# EAGLE design tinyblink-rev3.2.1 (EAGLE 7.3.0)
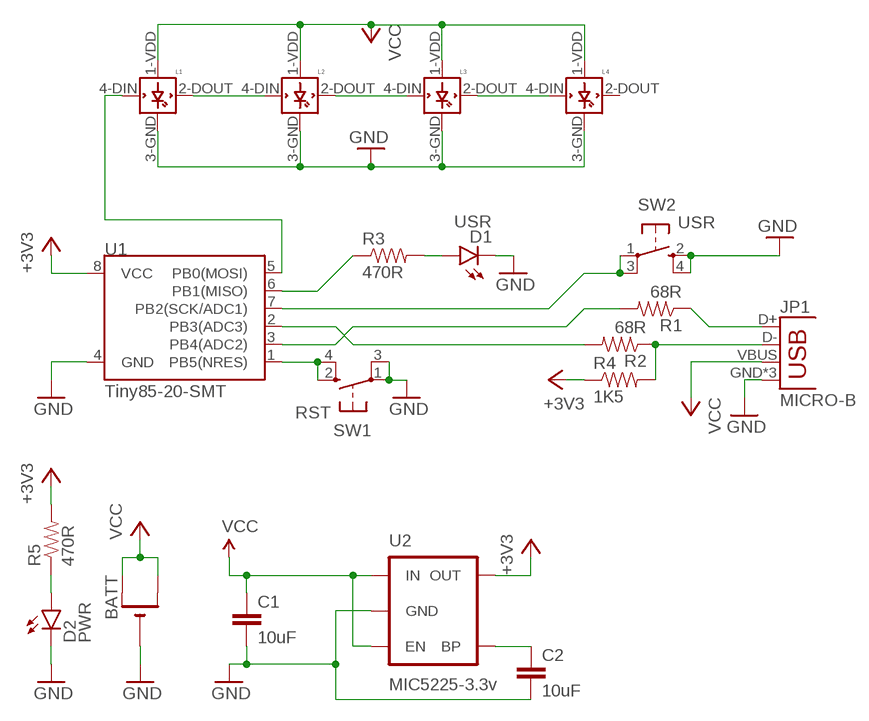
[diagram p0: schematic, sheet 1]

## Parts
BATT  CR2032SMT  [CR2032-SMD]
C1  10uF  CAP0603-CAP  [0603-CAP]
C2  10uF  CAP0603-CAP  [0603-CAP]
D1  USR  LED-RED0603  [LED-0603]
D2  PWR  LED-GREEN0603  [LED-0603]
JP1  MICRO-B  USB-MICROB  [USB-MICROB]
L1  WS2812B  [WS2812B]
L2  WS2812B  [WS2812B]
L3  WS2812B  [WS2812B]
L4  WS2812B  [WS2812B]
R1  68R  RESISTOR0603-RES  [0603-RES]
R2  68R  RESISTOR0603-RES  [0603-RES]
R3  470R  RESISTOR0603-RES  [0603-RES]
R4  1K5  RESISTOR0603-RES  [0603-RES]
R5  470R  RESISTOR0603-RES  [0603-RES]
SW1  RST  SPST_TACT-KMR2  [KMR2]
SW2  USR  SPST_TACT-KMR2  [KMR2]
U1  Tiny85-20-SMT  ATTINY45TINY85-20-SMT  [SO08-EIAJ]
U2  MIC5225-3.3v  MIC52053.3V  [SOT23-5]

## Nets
+3V3: R4.1 R5.2 U1.8(VCC) U2.5(OUT)
GND: BATT.- C1.2 C2.2 D1.C D2.C JP1.GND JP1.MT1(GND) JP1.MT2(GND) L1.3-GND(GND) L2.3-GND(GND) L3.3-GND(GND) L4.3-GND(GND) SW1.1(P) SW1.3(P1) SW2.2(S) SW2.4(S1) U1.4(GND) U2.2(GND)
N$1: SW1.2(S) SW1.4(S1) U1.1(PB5(NRES))
N$2: SW2.1(P) SW2.3(P1) U1.7(PB2(SCK/ADC1))
N$3: L1.4-DIN(DIN) U1.5(PB0(MOSI))
N$4: D1.A R3.2
N$5: JP1.D+ R1.1
N$6: JP1.D- R2.1 R4.2
N$7: C2.1 U2.4(BP)
N$8: L1.2-DOUT(DOUT) L2.4-DIN(DIN)
N$9: R2.2 U1.2(PB3(ADC3))
N$10: D2.A R5.1
N$11: R1.2 U1.3(PB4(ADC2))
N$13: L2.2-DOUT(DOUT) L3.4-DIN(DIN)
N$14: L3.2-DOUT(DOUT) L4.4-DIN(DIN)
N$15: R3.1 U1.6(PB1(MISO))
VCC: BATT.+$1(+) BATT.+$2(+1) C1.1 JP1.VBUS L1.1-VDD(VDD) L2.1-VDD(VDD) L3.1-VDD(VDD) L4.1-VDD(VDD) U2.1(IN) U2.3(EN)
Unconnected: L4.2-DOUT(DOUT)

## Library data of the parts
BATT = adafruit:CR2032
C1 C2 = SparkFun-Capacitors:CAP: Capacitor Standard 0603 ceramic capacitor, and 0.1" leaded capacitor.
D1 = SparkFun-LED:LED-RED: Assorted Red LEDs LilyPad 1206- DIO-09912 1206- DIO-00809 0603- DIO-00819 "SMART" means more efficient and expensive; PROD_ID: DIO-00819; VALUE: RED
D2 = SparkFun-LED:LED-GREEN: Various green LEDs Green LEDs used in SFE Production 0603- DIO-00821 LARGE- DIO-00862 LILYPAD- DIO-09910; PROD_ID: DIO-00821; VALUE: GREEN
JP1 = SparkFun-Connectors:USB: USB Connectors USB-B-PTH is fully proven SKU : PRT-00139/CONN-08278 USB-miniB is fully proven SKU : PRT-00587 USB-A-PCB is untested. USB-A-H is throughly reviewed, but untested. Spark Fun Electronics SKU : PRT-00437 USB-B-SMT is throughly reviewed, but untested. Needs silkscreen touching up. USB-A-S has not been used/tested USB-MB-H has not been used/tested USB-MICROB has been used. CONN-09505; PROD_ID: CONN-09505
L1-L4 = adafruit:WS2812B
R1-R5 = SparkFun-Passives:RESISTOR: Resistor Basic schematic elements and footprints for 0603, 1206, and PTH resistors.
SW1 SW2 = adafruit:SPST_TACT: SMT 6mm switch, EVQQ2 series http://www.ladyada.net/library/eagle
U1 = SparkFun-DigitalIC:ATTINY45: Atmel 8-pin 2/4/8kB flash uC; PROD_ID: IC-09092
U2 = SparkFun-PowerIC:MIC5205: MIC5205 150mA vreg 3.3V - VREG-00822 5V - VREG-00823; PROD_ID: VREG-00822

## Board
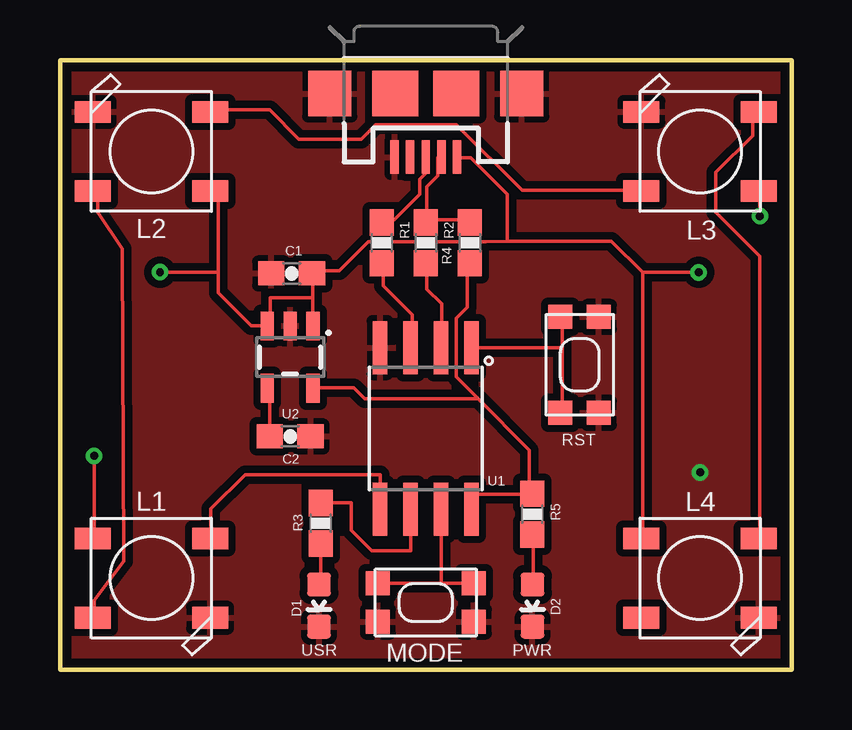
[diagram p1: board, top side]
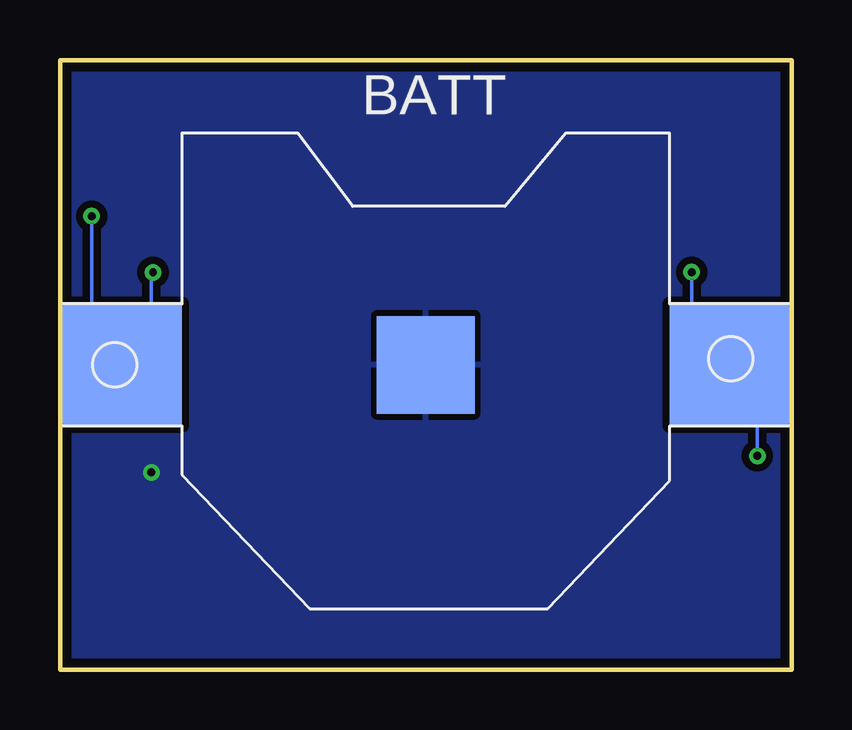
[diagram p2: board, bottom side, seen from below]

Size 30.48 x 25.4 mm. Coordinates in mm from the lower left corner, seen from the top.
Outline: 0,0 0,25.4 30.48,25.4 30.48,0 0,0
Copper layers (1*16): Top 0.0356mm / dielectric 1.5011mm / Bottom 0.0356mm
Design rules "LaenPCBOrder": minimum track width 6mil, minimum drill 13mil, track to track 6mil, track to pad 6mil, pad to pad 6mil, via to via 6mil, smd to smd 6mil, copper to edge 15mil, drill to drill 6mil, minimum pad ring 7mil, minimum via ring 7mil, stop-mask expansion 3mil, vias tented up to drill 0mil, thermal gap 10mil

### Footprints (pad centres in the part's own frame; a part is rotated, then mirrored left to right if it is on the bottom)
CR2032-SMD = smd 5.08 x 5.08: +$1 -12.7,0; +$2 12.7,0 | smd 4.064 x 4.064: - 0,0
0603-CAP = smd 1.1 x 1: 1 -0.85,0; 2 0.85,0
LED-0603 = smd 1 x 1: A 0,-0.877; C 0,0.877
USB-MICROB = smd 0.35 x 1.4: D+ 0,2.65; D- -0.65,2.65; GND 1.3,2.65; ID 0.65,2.65; VBUS -1.3,2.65 | smd 1.8 x 1.9: MT1 -4,0; MT2 4,0 | smd 1.9 x 1.9: P$1 -1.27,0; P$2 1.27,0
WS2812B = smd 1.5 x 0.9: 1-VDD 2.45,-1.65; 2-DOUT 2.45,1.65; 3-GND -2.45,1.65; 4-DIN -2.45,-1.65
0603-RES = smd 1.1 x 1: 1 -0.85,0; 2 0.85,0
KMR2 = smd 1 x 1: 1 2,0.8; 2 2,-0.8; 3 -2,0.8; 4 -2,-0.8
SO08-EIAJ = smd 0.61 x 2.21: 1 -1.905,-3.378; 2 -0.635,-3.378; 3 0.635,-3.378; 4 1.905,-3.378; 5 1.905,3.353; 6 0.635,3.353; 7 -0.635,3.353; 8 -1.905,3.353
SOT23-5 = smd 0.55 x 1.2: 1 -0.95,-1.3; 2 0,-1.3; 3 0.95,-1.3; 4 0.95,1.3; 5 -0.95,1.3

### Placement (x,y rotation side)
BATT  15.24,12.7 0 bottom
C1  9.65,16.51 180 top
C2  9.59,9.72 0 top
D1  10.8,2.67 180 top
D2  19.69,2.67 180 top
JP1  15.24,24 180 top
L1  3.81,3.81 180 top
L2  3.81,21.59 0 top
L3  26.67,21.59 0 top
L4  26.67,3.81 180 top
R1  13.4,17.78 270 top
R2  15.24,17.78 270 top
R3  10.86,6.1 270 top
R4  17.08,17.78 90 top
R5  19.69,6.48 90 top
SW1  21.65,12.7 270 top
SW2  15.24,2.79 0 top
U1  15.24,10.03 180 top
U2  9.59,13.02 180 top

### Tracks (layer width: path | path; a pad name or v marks a point on that pad's centre or on a via)
+3V3
  Top 0.152: U1.8 17.27,6.71 17.27,7.16 17.42,7.32 19.56,7.32 R5.2 19.56,7.47 19.56,9.14 17.4,11.3 | 17.4,11.3 16.51,12.19 16.51,14.63 16.97,15.09 16.97,16.92 R4.1 | U2.5 10.57,11.73 12.24,11.73 12.7,11.28 17.4,11.28 17.4,11.3
GND  (via drill 0.33)
  other vias: 26.67,8.22
  pour Top (isolate 0.305): 0,25.4 30.48,25.4 30.48,0 0,0
  pour Bottom (isolate 0.305): 0,25.4 30.48,25.4 30.48,0 0,0
N$1
  Top 0.152: 20.93,13.41 20.93,10.82 SW1.2 | SW1.4 20.93,14.63 20.93,13.46 20.93,13.41 | U1.1 20.93,13.41
N$2
  Top 0.152: U1.7 15.88,3.59 SW2.1 SW2.3
N$3
  Top 0.152: L1.4-DIN 6.29,5.46 6.29,6.7 7.71,8.13 13.34,8.13 U1.5
N$4
  Top 0.152: D1.A 10.87,3.66 10.87,5.49 R3.2
N$5
  Top 0.152: R1.1 13.46,18.75 13.92,18.75 14.99,19.81 14.99,20.42 15.29,20.73 15.29,21.34 JP1.D+
N$6
  Top 0.152: 15.29,18.75 16.97,18.75 R4.2 | 15.29,18.75 15.29,20.12 15.75,20.57 15.75,21.34 JP1.D- | 15.29,18.75 R2.1
N$7
  Top 0.152: C2.1 8.74,9.6 8.74,11.58 U2.4
N$8
  Top 0.152: L1.2-DOUT 1.42,2.29 1.42,2.9 2.65,4.51 2.59,17.53 1.58,19.05 1.58,19.66 1.42,19.81 L2.4-DIN
N$9
  Top 0.152: R2.2 15.29,16.92 15.29,15.85 15.9,15.24 15.9,13.41 U1.2
N$10
  Top 0.152: D2.A 19.71,3.66 19.71,5.49 R5.1
N$11
  Top 0.152: R1.2 13.46,16.92 13.46,16 14.68,14.78 14.68,13.41 U1.3
N$13
  Top 0.152: L2.2-DOUT 6.3,23.32 8.74,23.32 9.96,22.1 12.55,22.1 13.16,22.71 16.51,22.71 19.25,19.96 24.13,19.96 L3.4-DIN
N$14
  Top 0.152: L4.4-DIN 29.16,5.49 29.16,17.22 27.33,19.05 27.33,20.73 28.85,22.25 28.85,23.01 29.01,23.16 L3.2-DOUT
N$15
  Top 0.152: R3.1 12.13,6.95 12.13,5.81 12.98,4.95 14.61,4.95 U1.6
VCC  (via drill 0.33)
  Top 0.152: v29.16,18.9 29.16,19.81 L3.1-VDD | v1.42,8.9 1.42,5.49 L1.1-VDD | 6.6,16.56 6.6,19.51 6.3,19.81 L2.1-VDD | 6.6,16.56 6.6,15.7 7.98,14.33 8.59,14.33 U2.3 8.76,14.32 8.76,15.49 10.54,15.49 | C1.1 10.57,16.46 10.54,16.46 10.54,15.49 | 18.64,17.86 18.64,19.81 17.12,21.34 16.66,21.34 JP1.VBUS | 18.64,17.86 17.73,17.83 12.85,17.83 11.63,16.61 10.57,16.61 C1.1 | 18.64,17.86 22.97,17.86 24.28,16.55 | 24.28,16.55 24.28,5.49 L4.1-VDD | 10.41,16.61 C1.1 | v4.17,16.56 6.6,16.56 | 10.54,15.49 U2.1 | v26.61,16.55 24.28,16.55
  Bottom 0.152: 29.16,14.02 v29.16,18.9 | v1.42,8.9 1.42,11.58 BATT.+$2 3.02,12.74 4.17,12.74 v4.17,16.56 | 26.67,16.55 26.67,12.7
  Bottom 0.406: 29.16,14.02 27.94,14.02 BATT.+$1 26.67,12.7 | v26.61,16.55 26.67,16.55

### Text on the board
tNames: RST | USR | PWR | MODE